# Altium schematic sheet MCU.SchDoc
size A4; SheetNumber: 6; SheetTotal: 7; SPICEModelCacheQIVQBSLI: <root> / <DocumentId>QIVQBSLI</DocumentId> / </root>
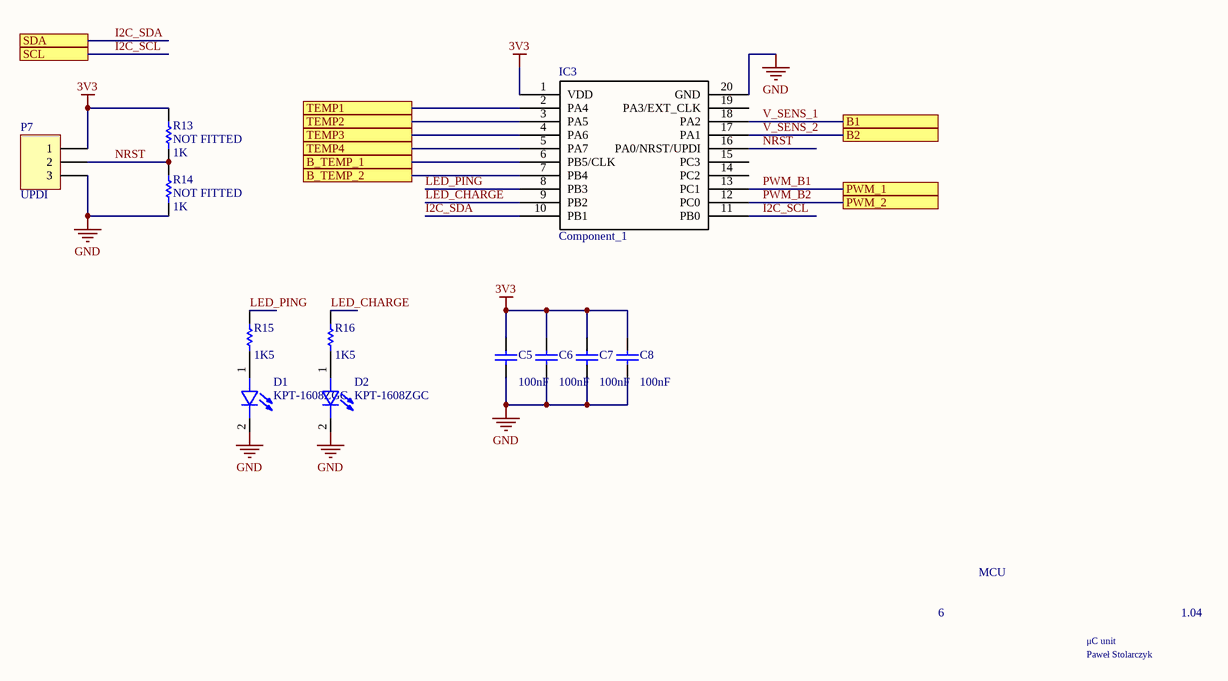
[diagram p0: MCU.SchDoc]

## Parts
C5  value 100nF  [0402]  (hidden comment: Cap)
C6  value 100nF  [0402]  (hidden comment: Cap)
C7  value 100nF  [0402]  (hidden comment: Cap)
C8  value 100nF  [0402]  (hidden comment: Cap)
D1  KPT-1608ZGC  [LED_KPT-1608ZGC]
D2  KPT-1608ZGC  [LED_KPT-1608ZGC]
IC3  Component_1  [SOIC127P1032X265-20N]
P7  UPDI  [HDR1X3]
R13  NOT FITTED  value 1K  [0402]
R14  NOT FITTED  value 1K  [0402]
R15  value 1K5  [0402]  (hidden comment: NOT FITTED)
R16  value 1K5  [0402]  (hidden comment: NOT FITTED)

## Ports
B1 (see BMS_SLAVE[3C], BAT_VOLTAGE_SENS[2C]), B2 (see BMS_SLAVE[3C], BAT_VOLTAGE_SENS[3C]), B_TEMP_1 (see BMS_SLAVE[3C], TEMP_SENSORS[3B]), B_TEMP_2 (see BMS_SLAVE[3C], TEMP_SENSORS[4B]), PWM_1 (see BMS_SLAVE[3B], BALANCER[3D]), PWM_2 (see BMS_SLAVE[3B], BALANCER[1B]), SCL (see BMS_SLAVE[3B], I2C[3C]), SDA (see BMS_SLAVE[3B], I2C[3C]), TEMP1 (see BMS_SLAVE[3C], TEMP_SENSORS[3B]), TEMP2 (see BMS_SLAVE[3C], TEMP_SENSORS[3B]), TEMP3 (see BMS_SLAVE[3C], TEMP_SENSORS[3C]), TEMP4 (see BMS_SLAVE[3C], TEMP_SENSORS[3C])

## Nets
3V3: C5.2 C6.2 C7.2 C8.2 IC3.1(VDD) P7.1 R13.1
GND: C5.1 C6.1 C7.1 C8.1 D1.2(C) D2.2(C) IC3.20(GND) P7.3 R14.2
B_TEMP_1: IC3.6(PB5/CLK) ; port B_TEMP_1
B_TEMP_2: IC3.7(PB4) ; port B_TEMP_2
I2C_SCL: IC3.11(PB0) ; port SCL
I2C_SDA: IC3.10(PB1) ; port SDA
LED_CHARGE: IC3.9(PB2) R16.1
LED_PING: IC3.8(PB3) R15.1
NRST: IC3.16(PA0/NRST/UPDI) P7.2 R13.2 R14.1
PWM_B1: IC3.13(PC1) ; port PWM_1
PWM_B2: IC3.12(PC0) ; port PWM_2
TEMP1: IC3.2(PA4) ; port TEMP1
TEMP2: IC3.3(PA5) ; port TEMP2
TEMP3: IC3.4(PA6) ; port TEMP3
TEMP4: IC3.5(PA7) ; port TEMP4
V_SENS_1: IC3.18(PA2) ; port B1
V_SENS_2: IC3.17(PA1) ; port B2
NetD1_1: D1.1(A) R15.2
NetD2_1: D2.1(A) R16.2

Not connected (* = marked no-connect by the designer): IC3 14(PC2) 15(PC3) 19(PA3/EXT_CLK)

## Notes on the sheet
- MCU
- 6
- μC unit
- 1.04
- Paweł Stolarczyk

## Library data of the parts
C5-C8 = Cap: Capacitor; Published: 8-Jun-2000; LatestRevisionDate: 17-Jul-2002; LatestRevisionNote: Re-released for DXP Platform.; PackageReference: RAD-0.3; Publisher: Altium Limited; PackageDescription: Radial Cap, Thru-Hole; 2 Leads; 0.3 in Pin Spacing
D1 D2 = KPT-1608ZGC: 1.6x0.8mm Smd Chip Led Lamp; MF: Kingbright; Value: *; SnapEDA_Link: https://www.snapeda.com/parts/KPT-1608ZGC/Kingbright/view-part/?ref=snap; Availability: In Stock; Price: None; Package: 0603 Kingbright; Check_prices: https://www.snapeda.com/parts/KPT-1608ZGC/Kingbright/view-part/?ref=eda; MP: KPT-1608ZGC
P7 = Header 3: Header, 3-Pin; LatestRevisionDate: 17-Jul-2002; LatestRevisionNote: Re-released for DXP Platform.; Publisher: Altium Limited
R13-R16 = Res1: Resistor; Published: 8-Jun-2000; LatestRevisionDate: 17-Jul-2002; LatestRevisionNote: Re-released for DXP Platform.; PackageReference: AXIAL-0.3; Publisher: Altium Limited; PackageDescription: Axial Device, Thru-Hole; 2 Leads; 0.3 in Pin Spacing